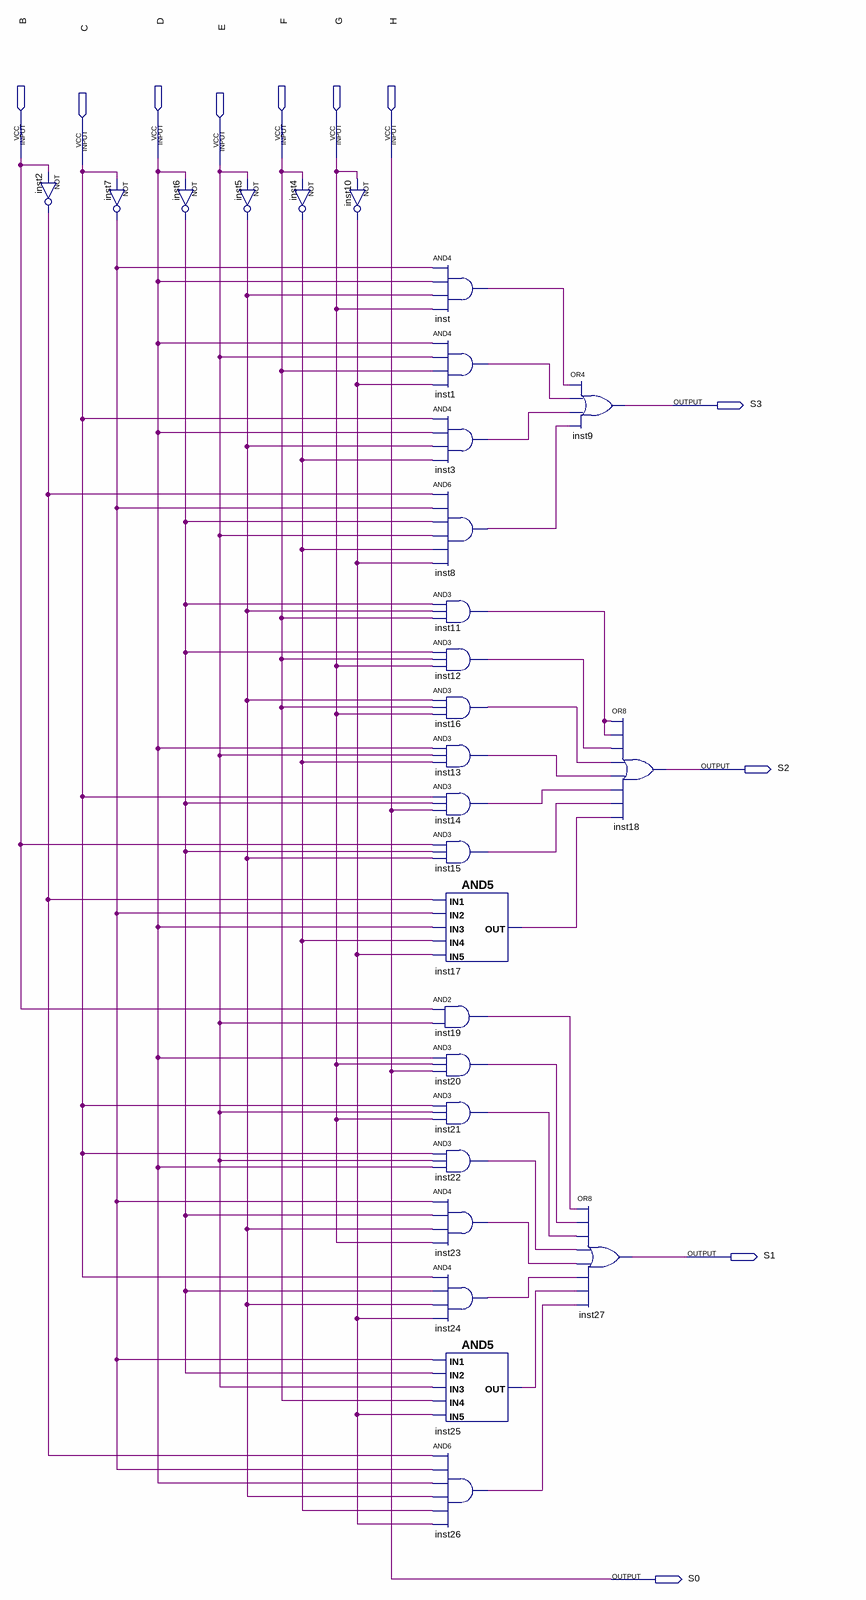
[diagram p0: schematic sheet]
// Quartus schematic BCDBAIXO.bdf as structural Verilog: 28 symbols, 11 pins
module BCDBAIXO (
  input  B,
  input  D,
  input  F,
  input  G,
  input  H,
  input  C,
  input  E,
  output S3,
  output S2,
  output S1,
  output S0
);

  wire inst1_out, inst2_out, inst3_out, inst4_out, inst5_out, inst6_out, inst7_out, inst8_out, inst10_out,
       inst11_out, inst12_out, inst13_out, inst14_out, inst15_out, inst16_out, inst17_out, inst19_out,
       inst20_out, inst21_out, inst22_out, inst23_out, inst24_out, inst25_out, inst26_out, inst_out;

  not inst2 (inst2_out, B);
  not inst7 (inst7_out, C);
  not inst6 (inst6_out, D);
  not inst5 (inst5_out, E);
  not inst4 (inst4_out, F);
  not inst10 (inst10_out, G);
  and inst (inst_out, inst7_out, D, inst5_out, G);
  and inst1 (inst1_out, D, E, F, inst10_out);
  and inst3 (inst3_out, C, D, inst5_out, inst4_out);
  and inst8 (inst8_out, inst2_out, inst7_out, inst6_out, E, inst4_out, inst10_out);
  and inst11 (inst11_out, inst6_out, inst5_out, F);
  and inst12 (inst12_out, inst6_out, F, G);
  and inst16 (inst16_out, inst5_out, F, G);
  and inst13 (inst13_out, D, E, inst4_out);
  and inst14 (inst14_out, C, inst6_out, H);
  and inst15 (inst15_out, B, inst6_out, inst5_out);
  and inst17 (inst17_out, inst2_out, inst7_out, D, inst4_out, inst10_out);
  and inst19 (inst19_out, B, E);
  and inst20 (inst20_out, D, G, H);
  and inst21 (inst21_out, C, E, G);
  and inst22 (inst22_out, C, E, D);
  and inst23 (inst23_out, inst7_out, inst6_out, inst5_out, G);
  and inst24 (inst24_out, C, inst6_out, inst5_out, inst10_out);
  and inst25 (inst25_out, inst7_out, inst6_out, E, F, inst10_out);
  and inst26 (inst26_out, inst2_out, inst7_out, D, inst5_out, inst4_out, inst10_out);
  or inst9 (S3, inst_out, inst1_out, inst3_out, inst8_out);
  or inst18 (S2, inst11_out, inst11_out, inst12_out, inst16_out, inst13_out, inst14_out, inst15_out, inst17_out);
  or inst27 (S1, inst19_out, inst20_out, inst21_out, inst22_out, inst23_out, inst24_out, inst25_out, inst26_out);

  assign S0 = H;
endmodule
